# Altium schematic sheet Sheet_Hall sensor.schdoc
size 77 x 48 mm
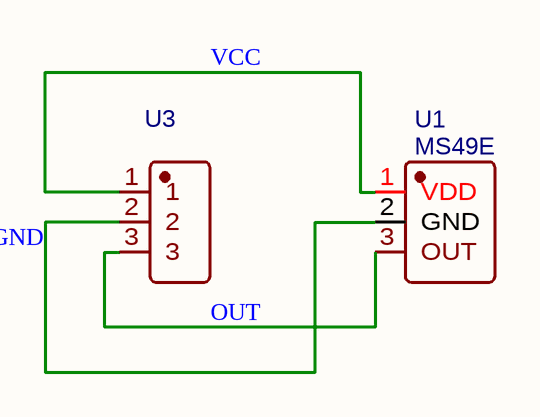
[diagram p0: Sheet_Hall sensor.schdoc]

## Parts
U1  MS49E  [TO-92S-3_L4.1-W1.7-P1.27-L]
U3  WAFER-PH2.0-3PZZ-R62  [CONN-TH_4P-P2.00_WAFER-PH2.0-3PZZ-R62]  (value not drawn)

## Nets
GND: U1.2(GND) U3.2
OUT: U1.3(OUT) U3.3
VCC: U1.1(VDD) U3.1

## Library data of the parts
U1 = MS49E: Manufacturer: 杭州瑞盟; Contributor: LCSC; Supplier: LCSC; Supplier Part: C1509062; Manufacturer Part: MS49E; JLCPCB Part Class: Extended Part; spicePre: U; spiceSymbolName: MS49E
U3 = WAFER-PH2.0-3PZZ-R62: Manufacturer: XUNPU(讯普); Contributor: lcsc; Supplier: LCSC; Supplier Part: C22390428; Manufacturer Part: WAFER-PH2.0-3PZZ-R62; JLCPCB Part Class: Extended Part; spicePre: U; spiceSymbolName: WAFER-PH2.0-3PZZ-R62